# Altium schematic sheet 8MHz_Crystal.SchDoc: 8MHz Crystal Oscillator Module
size A4; Author: Nikola Rašević; Organization: Memristor Robotics
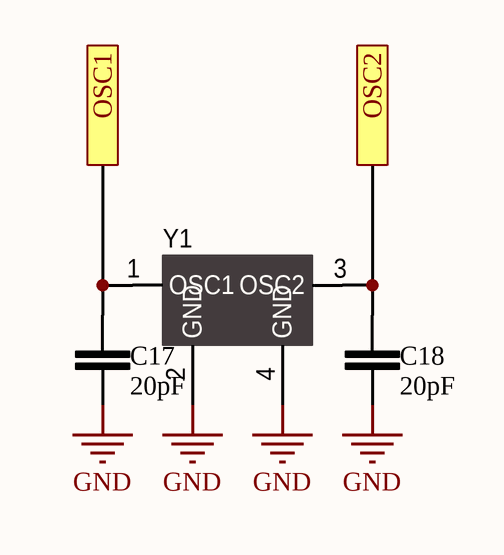
[diagram p0: 8MHz_Crystal.SchDoc]

## Parts
C17  20pF  [CER_0603]
C18  20pF  [CER_0603]
Y1  8Hz  [ABM10]  (value not drawn)

## Ports
OSC1, OSC2

## Nets
GND: C17.1 C18.1 Y1.2(GND) Y1.4(GND)
OSC1: C17.2 Y1.1(OSC1) ; port OSC1
OSC2: C18.2 Y1.3(OSC2) ; port OSC2

## Notes on the sheet
- Title
- Date:
- Design Engineer:
- Time:
- Revision:
- Sheet
- of
- Size:
- A4
- www.memristor-robotics.io
- File:

## Library data of the parts
C17 C18 = 00002200: CAP CER 20p 0805; Capacitance: 20pF
Y1 = QUARTZ_8MHz: CRYSTAL 8.0000MHZ 18PF SMD; Manufacturer: ABRACON; Manufacturer Part Number: ABMM2-8.000MHZ-E2-T; id: 17; Frequency Stability: ±30ppm; Equivalent Series Resistance: 72 Ohm; item_id: 4360; Category: Crystals and Oscillators; Assembly: SMD; Datasheet URL: http://www.abracon.com/Resonators/ABMM2.pdf; Package Case: 4-SMD, No Lead (DFN, LCC); Frequency: 8Hz; Frequency Tolerance: ±30ppm; Load Capacitance: 18pF; Family: CRYSTAL; Size Dimension: 0.126" L x 0.098" W (3.20mm x 2.50mm); Part Type: Crystals, Oscillators